# Altium schematic sheet Sheet1.SchDoc
size A4
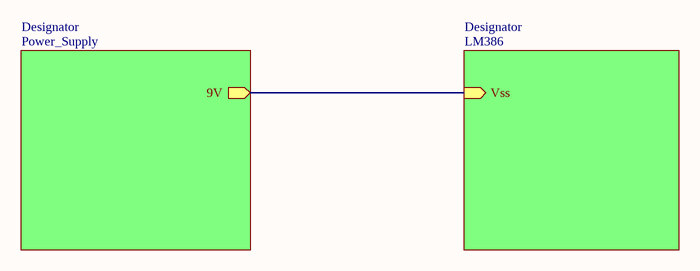
[diagram p0: Sheet1.SchDoc]

## Sub-sheets
Designator = Power_Supply: 9V (out)
Designator = LM386: Vss (in)

## Nets
(unnamed): sheet Designator/9V, sheet Designator/Vss